# EAGLE schematic untitled (EAGLE 9.5.0)

## Sheet 1 of 2
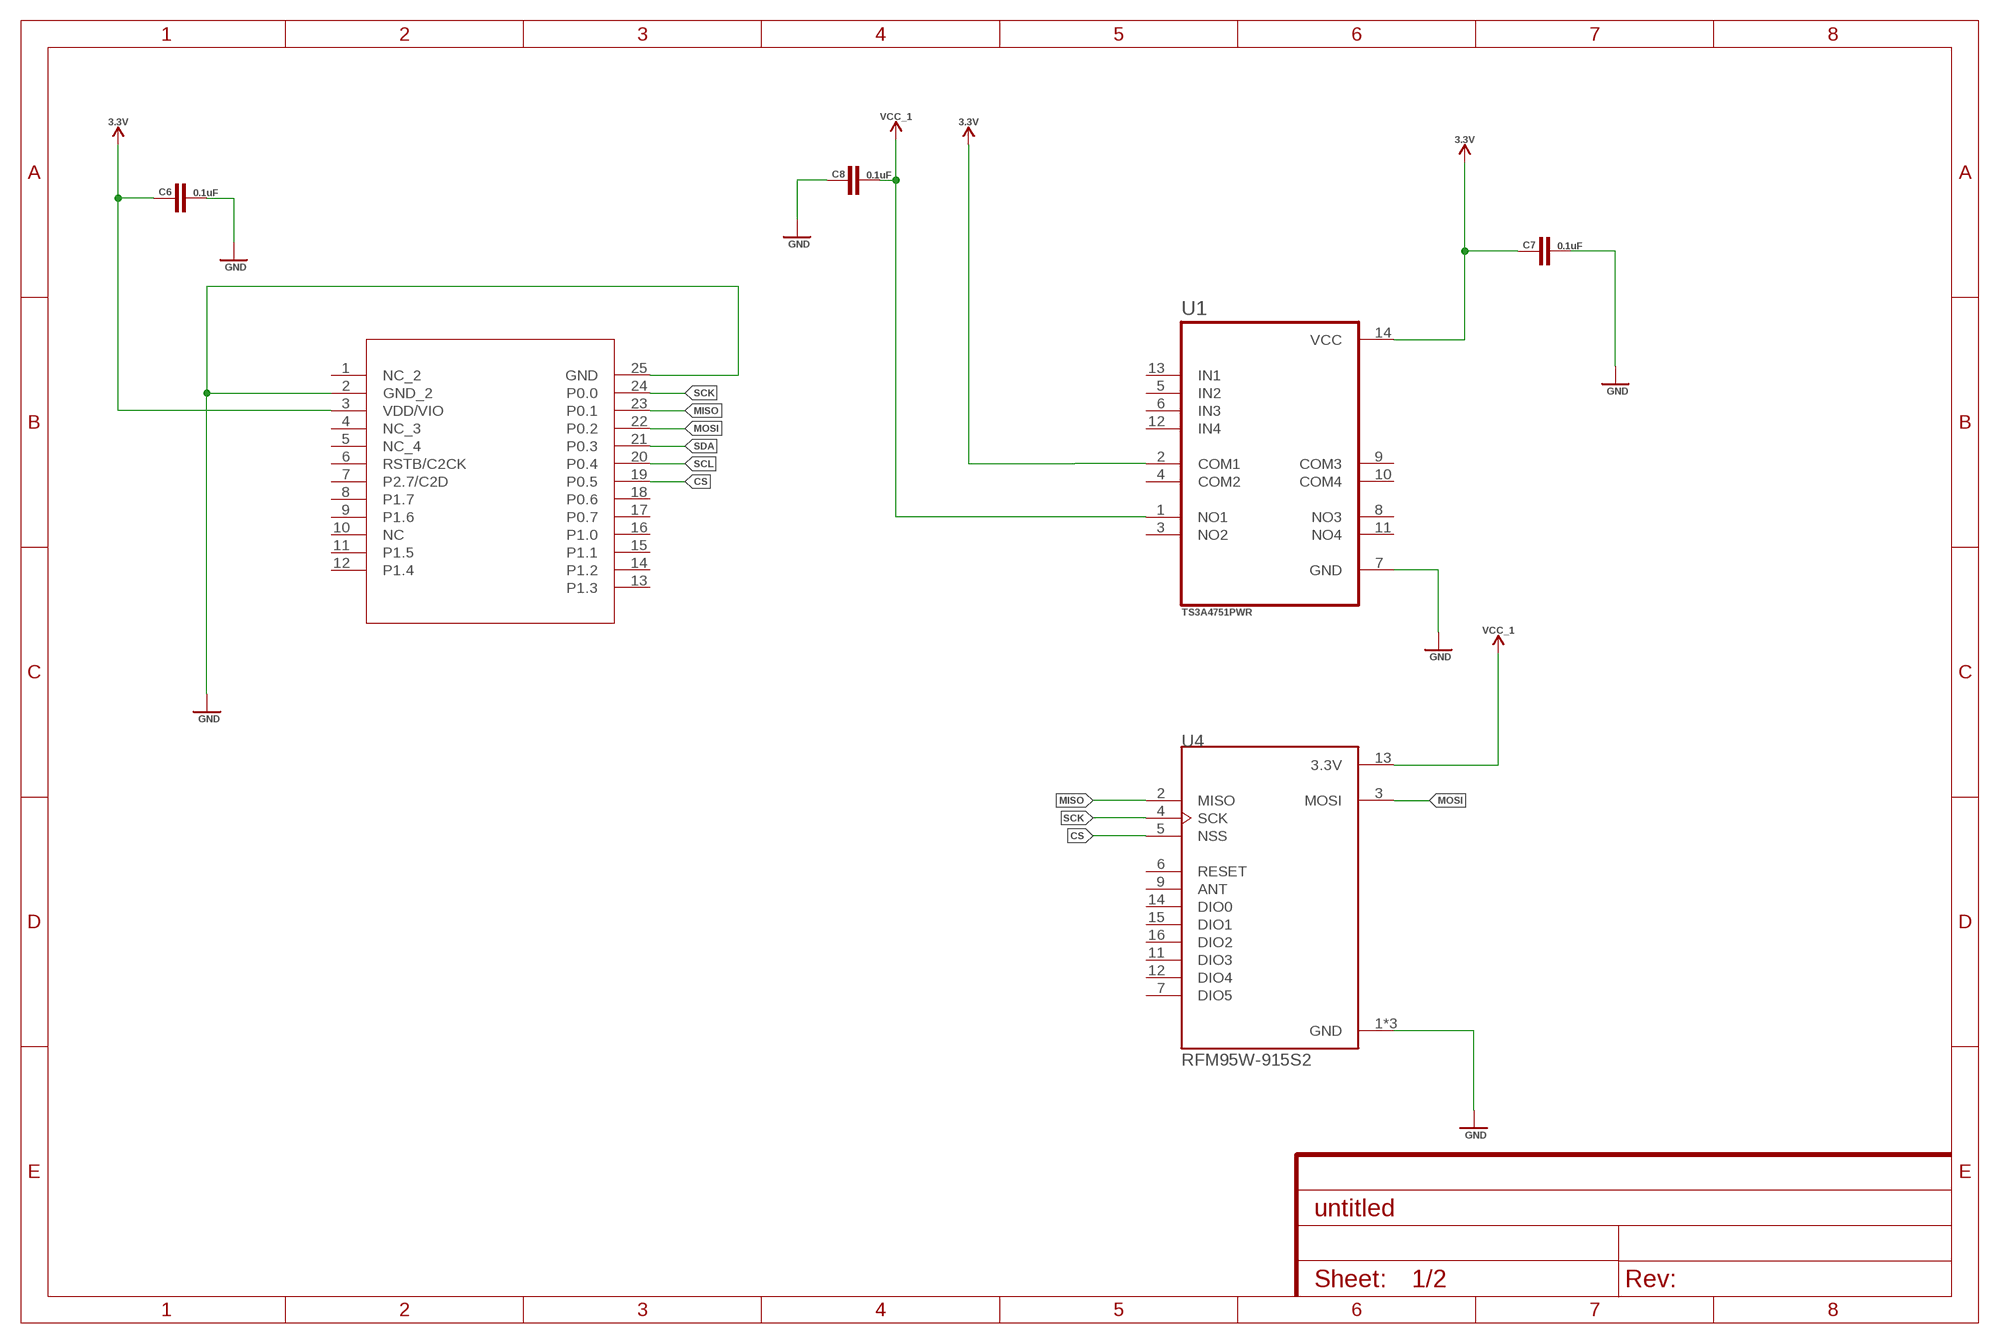
[diagram p0: schematic, sheet 1]

### Parts
C6  0.1uF  0.1UF-0603-25V-(+80/-20%)  [0603]
C7  0.1uF  0.1UF-0603-25V-(+80/-20%)  [0603]
C8  0.1uF  0.1UF-0603-25V-(+80/-20%)  [0603]
U1  TS3A4751PWR  [SOP65P640X120-14N]
U3  EFM8SB10F8G-A-QFN24QFN24_4X4-M  [QFN24_4X4-M]
U4  RFM95W-915S2  [XCVR_RFM95W-915S2]

### Nets
3.3V: C6.1 C7.1 U1.2(COM1) U1.14(VCC) U3.3(VDD/VIO) ; also sheet 2
CS: U3.19(P0.5) U4.5(NSS)
GND: C6.2 C7.2 C8.1 U1.7(GND) U3.2(GND_2) U3.25(GND) U4.1(GND) U4.8(GND) U4.10(GND) ; also sheet 2
MISO: U3.23(P0.1) U4.2(MISO)
MOSI: U3.22(P0.2) U4.3(MOSI)
SCK: U3.24(P0.0) U4.4(SCK)
SCL: U3.20(P0.4)
SDA: U3.21(P0.3)
VCC_1: C8.2 U1.1(NO1) U4.13(3.3V)
Unconnected: U1.3(NO2) U1.4(COM2) U1.5(IN2) U1.6(IN3) U1.8(NO3) U1.9(COM3) U1.10(COM4) U1.11(NO4) U1.12(IN4) U1.13(IN1) U3.1(NC_2) U3.4(NC_3) U3.5(NC_4) U3.6(RSTB/C2CK) U3.7(P2.7/C2D) U3.8(P1.7) U3.9(P1.6) U3.10(NC) U3.11(P1.5) U3.12(P1.4) U3.13(P1.3) U3.14(P1.2) U3.15(P1.1) U3.16(P1.0) U3.17(P0.7) U3.18(P0.6) U4.6(RESET) U4.7(DIO5) U4.9(ANT) U4.11(DIO3) U4.12(DIO4) U4.14(DIO0) U4.15(DIO1) U4.16(DIO2)

## Sheet 2 of 2
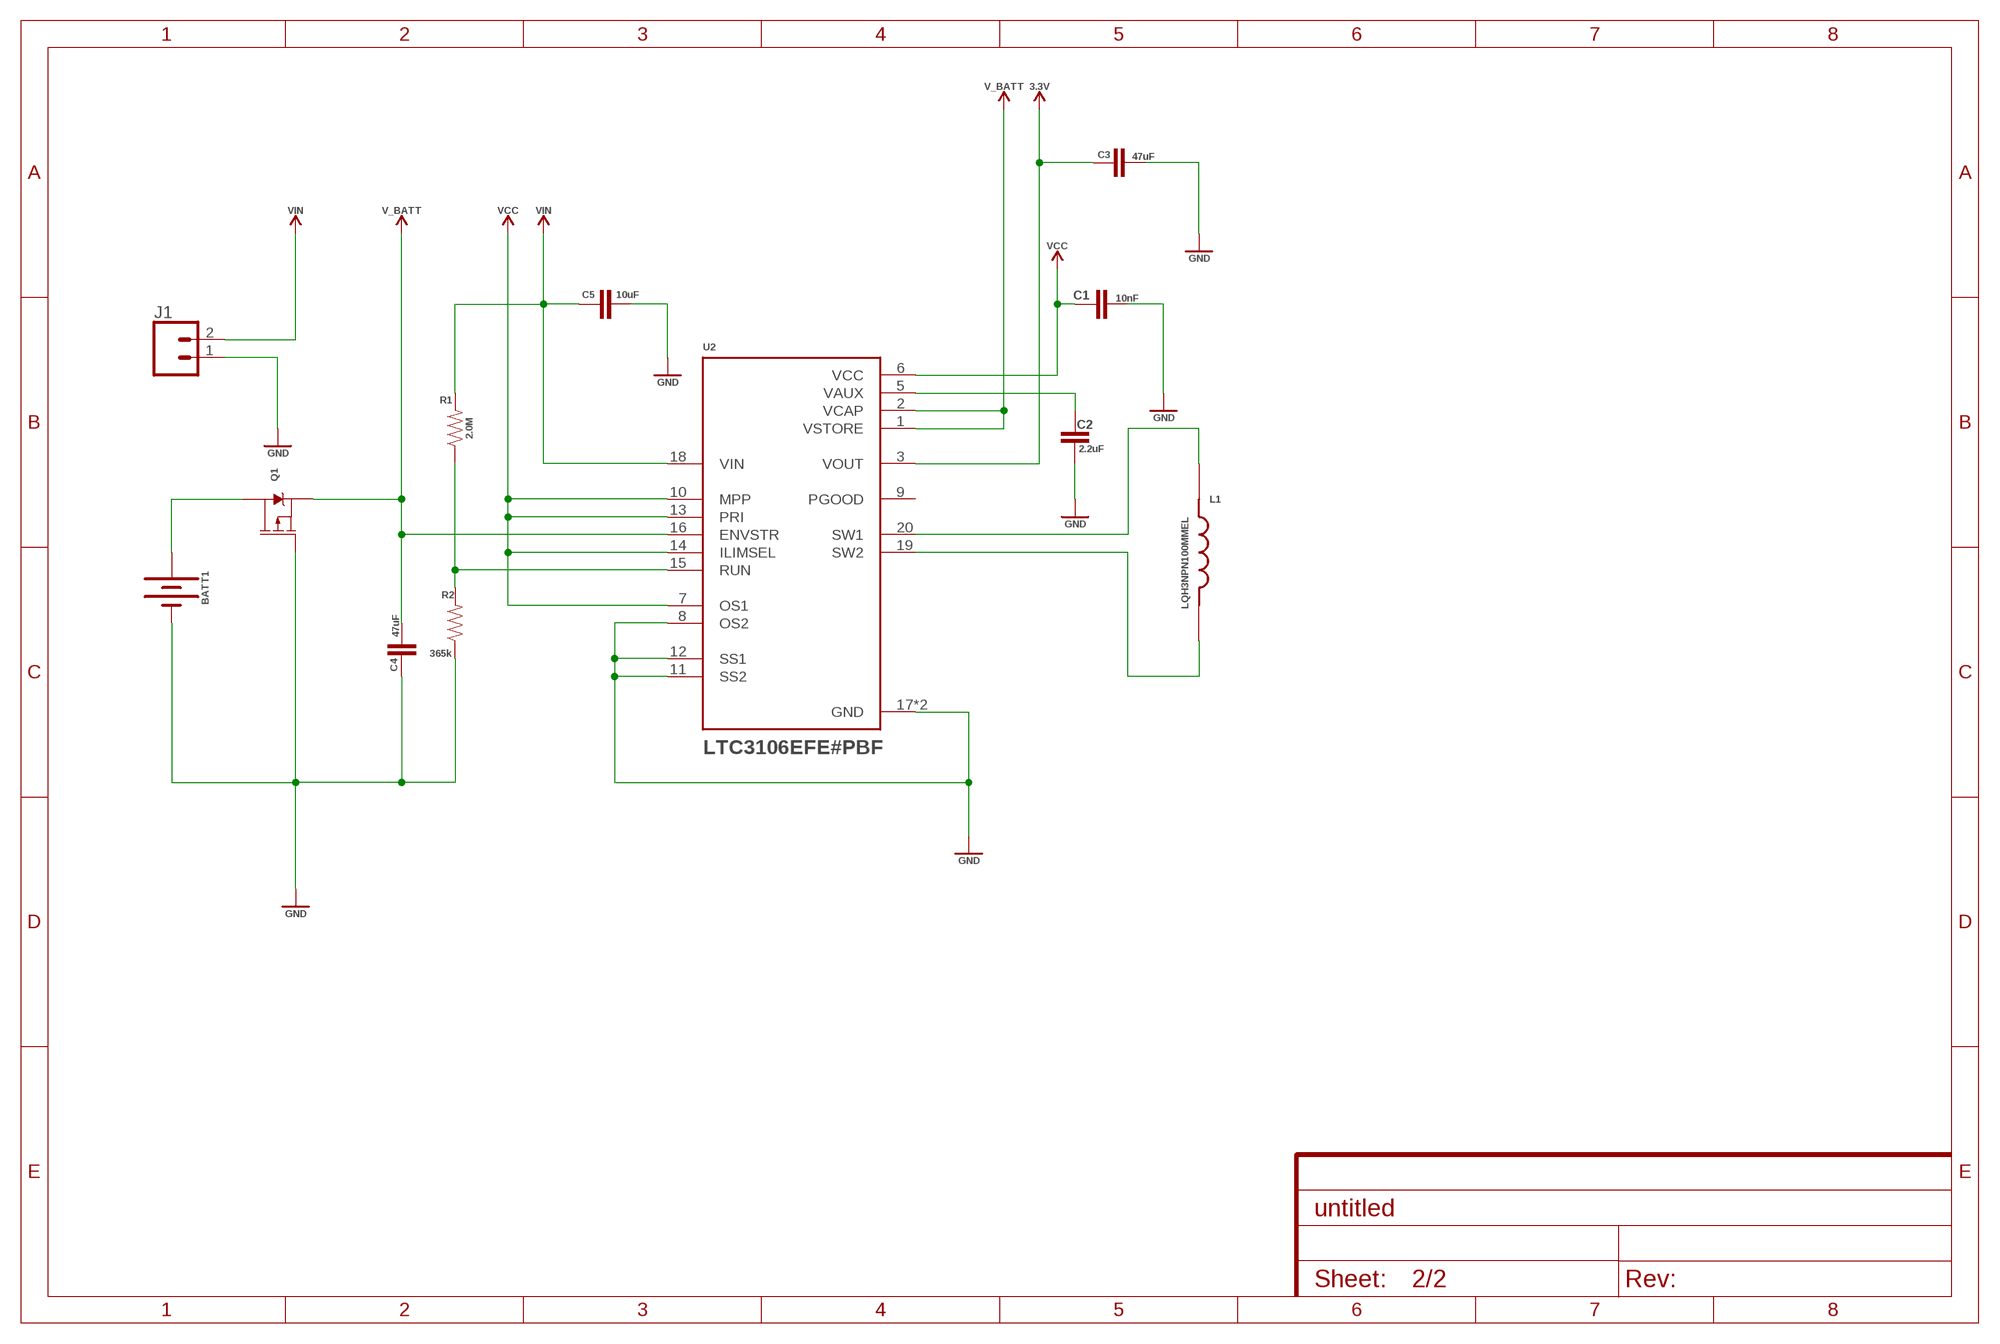
[diagram p1: schematic, sheet 2]

### Parts
BATT1  KEYSTONE_54KEYSTONE_2  [KEYSTONE_V2]
C1  10nF  10NF-0603-50V-10%  [0603]
C2  2.2uF  2.2UF-0603-10V-20%  [0603]
C3  47uF  4.7UF0603  [0603]
C4  47uF  4.7UF0603  [0603]
C5  10uF  10UF-0603-6.3V-20%  [0603]
J1  CONN_023.5MM  [SCREWTERMINAL-3.5MM-2]
L1  LQH3NPN100MMEL  [IND_LQH3NPN100MMEL]
Q1  2.5A/30V/105mΩ  MOSFET_PCH-DMG2307L  [SOT23-3]
R1  2.0M  2MOHMS-0603-1/10W-1%  [0603]
R2  365k  390KOHM-0603-1/10W-1%  [0603]
U2  LTC3106EFE#PBF  [SOP65P640X120-21N]

### Nets
3.3V: C3.1 U2.3(VOUT) ; also sheet 1
GND: BATT1.P$4(-) BATT1.P$5(-) BATT1.P$6(-) C1.2 C2.2 C3.2 C4.1 C5.2 J1.1 Q1.1(G) R2.1 U2.8(OS2) U2.11(SS2) U2.12(SS1) U2.17(GND) U2.21(GND) ; also sheet 1
N$1: L1.1 U2.20(SW1)
N$2: L1.2 U2.19(SW2)
N$3: C2.1 U2.5(VAUX)
N$4: BATT1.P$1(+) BATT1.P$2(+) BATT1.P$3(+) Q1.3(D)
N$5: R1.1 R2.2 U2.15(RUN)
V_BATT: C4.2 Q1.2(S) U2.1(VSTORE) U2.2(VCAP) U2.16(ENVSTR)
VCC: C1.1 U2.6(VCC) U2.7(OS1) U2.10(MPP) U2.13(PRI) U2.14(ILIMSEL)
VIN: C5.1 J1.2 R1.2 U2.18(VIN)
Unconnected: U2.9(PGOOD)

## Library data of the parts
BATT1 = battery_54:KEYSTONE_54
C1 = SparkFun-Capacitors:10NF: 0.01uF/10nF/10,000pF ceramic capacitors A capacitor is a passive two-terminal electrical component used to store electrical energy temporarily in an electric field. CAP-09321; PROD_ID: CAP-00867
C2 = SparkFun-Capacitors:2.2UF: 2.2µF ceramic capacitors A capacitor is a passive two-terminal electrical component used to store electrical energy temporarily in an electric field.; PROD_ID: CAP-07888
C3 C4 = SparkFun-Capacitors:4.7UF: 4.7µF ceramic capacitors A capacitor is a passive two-terminal electrical component used to store electrical energy temporarily in an electric field.; PROD_ID: CAP-08280; VALUE: 4.7uF
C5 = SparkFun-Capacitors:10UF: 10.0µF ceramic capacitors A capacitor is a passive two-terminal electrical component used to store electrical energy temporarily in an electric field.; PROD_ID: CAP-11015
C6-C8 = SparkFun-Capacitors:0.1UF: 0.1µF ceramic capacitors A capacitor is a passive two-terminal electrical component used to store electrical energy temporarily in an electric field.; PROD_ID: CAP-00810
J1 = SparkFun-Connectors:CONN_02: Multi connection point. Often used as Generic Header-pin footprint for 0.1 inch spaced/style header connections On any of the 0.1 inch spaced packages, you can populate with these: Break Away Headers - Straight <https://www.sparkfun.com/products/116> (PRT-00116) Break Away Male Headers - Right Angle <https://www.sparkfun.com/products/553> (PRT-00553) Female Headers <https://www.sparkfun.com/products/115> (PRT-00115) Break Away Headers - Machine Pin <https://www.sparkfun.com/products/117> (PRT-00117) Break Away Female Headers - Swiss Machine Pin <https://www.sparkfun.com/products/743> (PRT-00743) For SCREWTERMINALS and SPRING TERMINALS visit here: Screw Terimnals on SparkFun.com <https://www.sparkfun.com/search/results?term=Screw+Terminals> (5mm/3.5mm/2.54mm spacing) This device is also useful as a general connection point to wire up your design to another part of your project. Our various solder wires solder well into these plated through hole pads. Hook-Up Wire - Assortment (Stranded, 22 AWG) <https://www.sparkfun.com/products/11375> (PRT-11375) Hook-Up Wire - Assortment (Solid Core, 22 AWG) <https://www.sparkfun.com/products/11367> (PRT-11367) View the entire wire category on our website here <https://www.sparkfun.com/categories/141> Special notes: Molex polarized connector foot print use with: PRT-08233 with associated crimp pins and housings. 2.54_SCREWTERM for use with PRT-10571. 3.5mm Screw Terminal footprints for PRT-08084 5mm Screw Terminal footprints for use with PRT-08432; PROD_ID: CONN-08399
L1 = LQH3NPN100MMEL:LQH3NPN100MMEL: Fixed Inductors; DESCRIPTION: 10µH Shielded Wirewound Inductor 800mA 228mOhm Max 1212 (3030 Metric); DIGI-KEY_PART_NUMBER: 490-15945-1-ND; DIGIKEY-PURCHASE-URL: https://snapeda.com/shop?store=DigiKey&id=4547508; MF: Murata; MOUSER-PURCHASE-URL: https://snapeda.com/shop?store=Mouser&id=4547508; MP: LQH3NPN100MMEL; PACKAGE: 1212 Murata
Q1 = SparkFun-DiscreteSemi:MOSFET_PCH: P-channel MOSFETs Voltage controlled devices that allow control of high current outputs. SparkFun Products: SparkFun ESP32 Thing <https://www.sparkfun.com/products/13907> SparkFun ESP8266 Thing <https://www.sparkfun.com/products/13231>; PROD_ID: TRANS-11308
R1 = SparkFun-Resistors:2MOHMS: 2MΩ resistor A resistor is a passive two-terminal electrical component that implements electrical resistance as a circuit element. Resistors act to reduce current flow, and, at the same time, act to lower voltage levels within circuits. - Wikipedia; PROD_ID: RES-10054
R2 = SparkFun-Resistors:390KOHM: 390kΩ resistor A resistor is a passive two-terminal electrical component that implements electrical resistance as a circuit element. Resistors act to reduce current flow, and, at the same time, act to lower voltage levels within circuits. - Wikipedia; PROD_ID: RES-12024; VALUE: 390k
U1 = TS3A4751PWR:TS3A4751PWR; ARROW_ELECTRONICS-PURCHASE-URL: https://snapeda.com/shop?store=Arrow+Electronics&id=361966; DESCRIPTION: 0.9-?, 3.3-V, 1:1 (SPST), 4-channel analog switch with 1.8-V input logic 14-TSSOP -40 to 85; DIGI-KEY_PART_NUMBER: 296-20700-1-ND; DIGIKEY-PURCHASE-URL: https://snapeda.com/shop?store=DigiKey&id=361966; MF: Texas Instruments; MOUSER-PURCHASE-URL: https://snapeda.com/shop?store=Mouser&id=361966; MP: TS3A4751PWR; PACKAGE: TSSOP-14 Texas Instruments; TEXAS_INSTRUMENTS-PURCHASE-URL: https://snapeda.com/shop?store=Texas+Instruments&id=361966
U2 = LTC3106EFE_PBF:LTC3106EFE#PBF: LTC3106 - 300mA Low Voltage Buck-Boost Converter with PowerPath and 1.6μA Quiescent Current; DESCRIPTION: Conv DC-DC -0.3V to 6V Non-Inv/Inv/Step Up/Step Down Single-Out 1.8V/2.2V/3.3V/5V 0.3A 20-Pin TSSOP; MF: Analog Devices; MOUSER-PURCHASE-URL: https://snapeda.com/shop?store=Mouser&id=4332360; MP: LTC3106EFE#PBF; PACKAGE: TSSOP W/ EP-20 Analog Devices
U3 = EFM8SB10F8A-A-QFN24:EFM8SB10F8G-A-QFN24; COPYRIGHT: Copyright (C) 2016 Accelerated Designs. All rights reserved; MANUFACTURER_PART_NUMBER: EFM8SB10F8G-A-QFN24; VENDOR: Silicon Labs
U4 = RFM95W-915S2:RFM95W-915S2: RFM95(W) - Low Power Long Range Transceiver Module V1.0 Buy Part <https://snapeda.com/parts/RFM95W-915S2/RF%20Solutions/view-part/?ref=eda>; AVAILABILITY: Bad; DESCRIPTION: General ISM < 1GHz LoRa™ Transceiver Module 915MHz Surface Mount; MF: RF Solutions; MOUSER-PURCHASE-URL: https://snapeda.com/shop?store=Mouser&id=585488; MP: RFM95W-915S2; PACKAGE: SMD-16 RF Solutions; PRICE: None